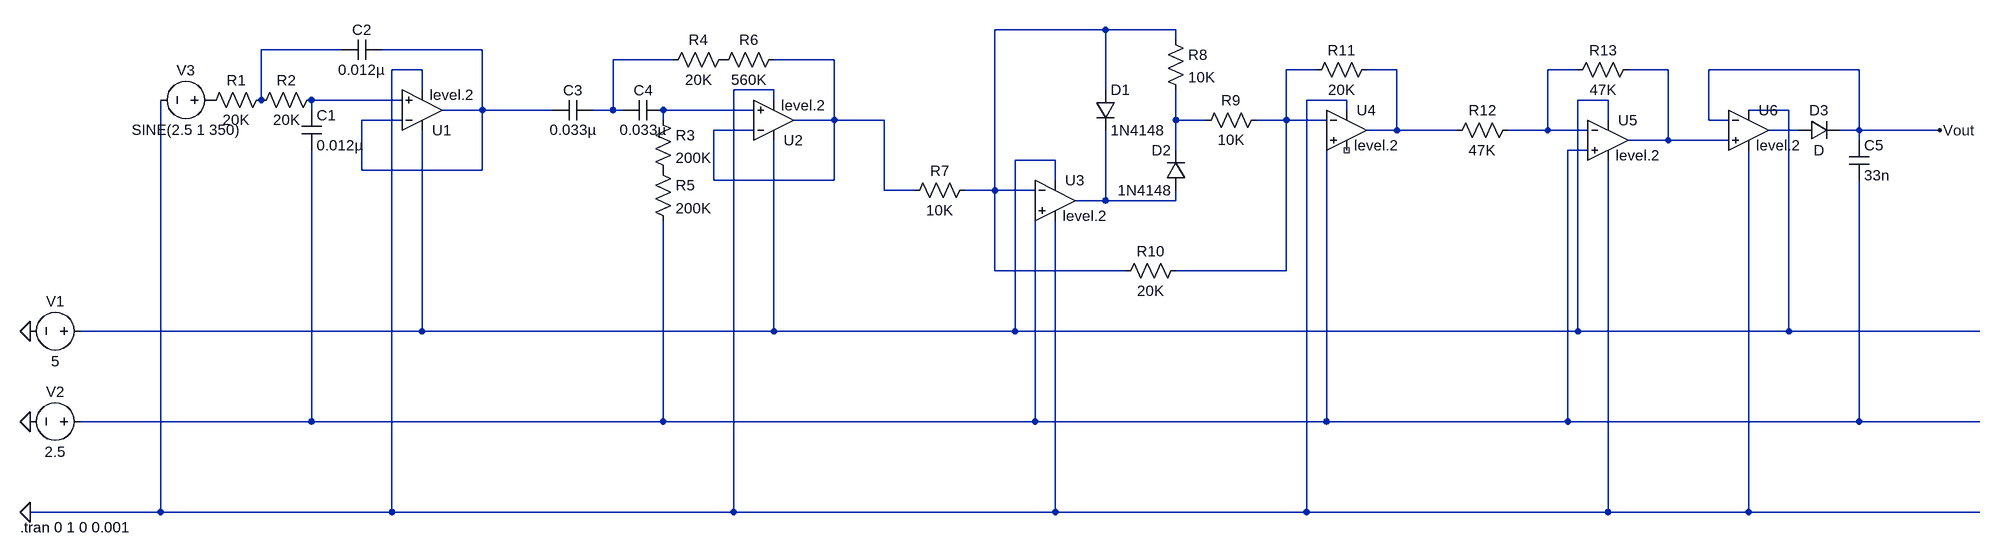
[diagram p0: schematic schematic.asc]
schematic.asc, the LTspice schematic file:
Version 4
SHEET 1 2988 880
WIRE 1424 48 1248 48
WIRE 1536 48 1424 48
WIRE 1536 64 1536 48
WIRE 208 80 80 80
WIRE 432 80 272 80
WIRE 736 96 640 96
WIRE 992 96 896 96
WIRE 336 112 288 112
WIRE 1760 112 1712 112
WIRE 1888 112 1840 112
WIRE 2176 112 2128 112
WIRE 2320 112 2256 112
WIRE 2624 112 2384 112
WIRE 336 144 336 112
WIRE 896 144 832 144
WIRE 1424 144 1424 48
WIRE 80 160 80 80
WIRE 304 160 160 160
WIRE 896 160 896 144
WIRE 1808 160 1744 160
WIRE 2224 160 2176 160
WIRE 160 176 160 160
WIRE 432 176 432 80
WIRE 432 176 368 176
WIRE 544 176 432 176
WIRE 640 176 640 96
WIRE 640 176 608 176
WIRE 656 176 640 176
WIRE 864 176 720 176
WIRE 1808 176 1808 160
WIRE 2512 176 2448 176
WIRE 304 192 240 192
WIRE 720 192 720 176
WIRE 992 192 992 96
WIRE 992 192 928 192
WIRE 1072 192 992 192
WIRE 1536 192 1536 144
WIRE 1584 192 1536 192
WIRE 1712 192 1712 112
WIRE 1712 192 1664 192
WIRE 1776 192 1712 192
WIRE 2224 192 2224 160
WIRE 2384 192 2384 112
WIRE 2416 192 2384 192
WIRE 864 208 800 208
WIRE 1888 208 1888 112
WIRE 1888 208 1840 208
WIRE 1984 208 1888 208
WIRE 2128 208 2128 112
WIRE 2128 208 2064 208
WIRE 2192 208 2128 208
WIRE 2528 208 2480 208
WIRE 2624 208 2624 112
WIRE 2624 208 2592 208
WIRE 2752 208 2624 208
WIRE 2320 224 2320 112
WIRE 2320 224 2256 224
WIRE 2416 224 2320 224
WIRE 2624 224 2624 208
WIRE 1536 240 1536 192
WIRE 2192 240 2160 240
WIRE 1344 256 1280 256
WIRE 240 272 240 192
WIRE 432 272 432 176
WIRE 432 272 240 272
WIRE 800 288 800 208
WIRE 992 288 992 192
WIRE 992 288 800 288
WIRE 1344 288 1344 256
WIRE 1072 304 1072 192
WIRE 1120 304 1072 304
WIRE 1248 304 1248 48
WIRE 1248 304 1200 304
WIRE 1312 304 1248 304
WIRE 1424 320 1424 208
WIRE 1424 320 1376 320
WIRE 1536 320 1536 304
WIRE 1536 320 1424 320
WIRE 1248 432 1248 304
WIRE 1456 432 1248 432
WIRE 1712 432 1712 192
WIRE 1712 432 1536 432
WIRE 336 528 336 208
WIRE 336 528 -208 528
WIRE 896 528 896 224
WIRE 896 528 336 528
WIRE 1280 528 1280 256
WIRE 1280 528 896 528
WIRE 2176 528 2176 160
WIRE 2176 528 1280 528
WIRE 2512 528 2512 176
WIRE 2512 528 2176 528
WIRE 2816 528 2512 528
WIRE 160 672 160 240
WIRE 160 672 -208 672
WIRE 720 672 720 352
WIRE 720 672 160 672
WIRE 1312 672 1312 336
WIRE 1312 672 720 672
WIRE 1776 672 1776 224
WIRE 1776 672 1312 672
WIRE 2160 672 2160 240
WIRE 2160 672 1776 672
WIRE 2624 672 2624 288
WIRE 2624 672 2160 672
WIRE 2816 672 2624 672
WIRE -80 816 -80 160
WIRE -80 816 -288 816
WIRE 288 816 288 112
WIRE 288 816 -80 816
WIRE 832 816 832 144
WIRE 832 816 288 816
WIRE 1344 816 1344 352
WIRE 1344 816 832 816
WIRE 1744 816 1744 160
WIRE 1744 816 1344 816
WIRE 2224 816 2224 256
WIRE 2224 816 1744 816
WIRE 2448 816 2448 240
WIRE 2448 816 2224 816
WIRE 2816 816 2448 816
FLAG -288 816 0
FLAG -288 528 0
FLAG -288 672 0
FLAG 2752 208 Vout
SYMBOL res 96 144 R90
WINDOW 0 0 56 VBottom 2
WINDOW 3 32 56 VTop 2
SYMATTR InstName R1
SYMATTR Value 20K
SYMBOL res 176 144 R90
WINDOW 0 0 56 VBottom 2
WINDOW 3 32 56 VTop 2
SYMATTR InstName R2
SYMATTR Value 20K
SYMBOL cap 144 176 R0
SYMATTR InstName C1
SYMATTR Value 0.012µ
SYMBOL opamps\\UniversalOpamp2 336 176 M180
WINDOW 38 12 24 Left 2
SYMATTR InstName U1
SYMATTR Value2 Avol=0.14Meg GBW=1.2Meg Slew=0.5Meg
SYMATTR SpiceLine ilimit=25m rail=0.5 Vos=0.2e-3 phimargin=56
SYMATTR SpiceLine2 en=0 enk=0 in=0 ink=0 Rin=10Meg
SYMBOL cap 272 64 R90
WINDOW 0 0 32 VBottom 2
WINDOW 3 32 32 VTop 2
SYMATTR InstName C2
SYMATTR Value 0.012µ
SYMBOL opamps\\UniversalOpamp2 896 192 M180
WINDOW 38 12 24 Left 2
SYMATTR InstName U2
SYMATTR Value2 Avol=0.14Meg GBW=1.2Meg Slew=0.5Meg
SYMATTR SpiceLine ilimit=25m rail=0.5 Vos=0.2e-3 phimargin=56
SYMATTR SpiceLine2 en=0 enk=0 in=0 ink=0 Rin=10Meg
SYMBOL res 704 176 R0
SYMATTR InstName R3
SYMATTR Value 200K
SYMBOL res 832 80 R90
WINDOW 0 0 56 VBottom 2
WINDOW 3 32 56 VTop 2
SYMATTR InstName R4
SYMATTR Value 20K
SYMBOL cap 608 160 R90
WINDOW 0 0 32 VBottom 2
WINDOW 3 32 32 VTop 2
SYMATTR InstName C3
SYMATTR Value 0.033µ
SYMBOL cap 720 160 R90
WINDOW 0 0 32 VBottom 2
WINDOW 3 32 32 VTop 2
SYMATTR InstName C4
SYMATTR Value 0.033µ
SYMBOL res 704 256 R0
SYMATTR InstName R5
SYMATTR Value 200K
SYMBOL res 912 80 R90
WINDOW 0 0 56 VBottom 2
WINDOW 3 32 56 VTop 2
SYMATTR InstName R6
SYMATTR Value 560K
SYMBOL voltage -192 528 R90
WINDOW 0 -32 56 VBottom 2
WINDOW 3 32 56 VTop 2
WINDOW 123 0 0 Left 0
WINDOW 39 0 0 Left 0
SYMATTR InstName V1
SYMATTR Value 5
SYMBOL voltage -192 672 R90
WINDOW 0 -32 56 VBottom 2
WINDOW 3 32 56 VTop 2
WINDOW 123 0 0 Left 0
WINDOW 39 0 0 Left 0
SYMATTR InstName V2
SYMATTR Value 2.5
SYMBOL res 1216 288 R90
WINDOW 0 0 56 VBottom 2
WINDOW 3 32 56 VTop 2
SYMATTR InstName R7
SYMATTR Value 10K
SYMBOL opamps\\UniversalOpamp2 1344 320 R0
WINDOW 38 12 24 Left 2
SYMATTR InstName U3
SYMATTR Value2 Avol=0.14Meg GBW=1.2Meg Slew=0.5Meg
SYMATTR SpiceLine ilimit=25m rail=0.5 Vos=0.2e-3 phimargin=56
SYMATTR SpiceLine2 en=0 enk=0 in=0 ink=0 Rin=10Meg
SYMBOL diode 1408 144 R0
SYMATTR InstName D1
SYMATTR Value 1N4148
SYMBOL diode 1552 304 R180
WINDOW 0 24 64 Left 2
WINDOW 3 24 0 Left 2
SYMATTR InstName D2
SYMATTR Value 1N4148
SYMBOL res 1520 48 R0
SYMATTR InstName R8
SYMATTR Value 10K
SYMBOL res 1680 176 R90
WINDOW 0 0 56 VBottom 2
WINDOW 3 32 56 VTop 2
SYMATTR InstName R9
SYMATTR Value 10K
SYMBOL opamps\\UniversalOpamp2 1808 208 R0
WINDOW 38 12 24 Left 2
SYMATTR InstName U4
SYMATTR Value2 Avol=0.14Meg GBW=1.2Meg Slew=0.5Meg
SYMATTR SpiceLine ilimit=25m rail=0.5 Vos=0.2e-3 phimargin=56
SYMATTR SpiceLine2 en=0 enk=0 in=0 ink=0 Rin=10Meg
SYMBOL res 1856 96 R90
WINDOW 0 0 56 VBottom 2
WINDOW 3 32 56 VTop 2
SYMATTR InstName R11
SYMATTR Value 20K
SYMBOL voltage 16 160 R90
WINDOW 0 -32 56 VBottom 2
WINDOW 3 32 56 VTop 2
WINDOW 123 0 0 Left 0
WINDOW 39 0 0 Left 0
SYMATTR InstName V3
SYMATTR Value SINE(2.5 1 350)
SYMBOL res 1552 416 R90
WINDOW 0 0 56 VBottom 2
WINDOW 3 32 56 VTop 2
SYMATTR InstName R10
SYMATTR Value 20K
SYMBOL res 2080 192 R90
WINDOW 0 0 56 VBottom 2
WINDOW 3 32 56 VTop 2
SYMATTR InstName R12
SYMATTR Value 47K
SYMBOL opamps\\UniversalOpamp2 2224 224 R0
WINDOW 38 12 24 Left 2
SYMATTR InstName U5
SYMATTR Value2 Avol=0.14Meg GBW=1.2Meg Slew=0.5Meg
SYMATTR SpiceLine ilimit=25m rail=0.5 Vos=0.2e-3 phimargin=56
SYMATTR SpiceLine2 en=0 enk=0 in=0 ink=0 Rin=10Meg
SYMBOL res 2272 96 R90
WINDOW 0 0 56 VBottom 2
WINDOW 3 32 56 VTop 2
SYMATTR InstName R13
SYMATTR Value 47K
SYMBOL opamps\\UniversalOpamp2 2448 208 R0
WINDOW 38 12 24 Left 2
SYMATTR InstName U6
SYMATTR Value2 Avol=0.14Meg GBW=1.2Meg Slew=0.5Meg
SYMATTR SpiceLine ilimit=25m rail=0.5 Vos=0.2e-3 phimargin=56
SYMATTR SpiceLine2 en=0 enk=0 in=0 ink=0 Rin=10Meg
SYMBOL diode 2528 224 R270
WINDOW 0 32 32 VTop 2
WINDOW 3 0 32 VBottom 2
SYMATTR InstName D3
SYMBOL cap 2608 224 R0
SYMATTR InstName C5
SYMATTR Value 33n
TEXT -304 840 Left 2 !.tran 0 1 0 0.001

The netlist it stands for:
* schematic.asc
R1 N002 P001 20K
R2 N010 N002 20K
C1 N010 N015 0.012µ
XU1 N010 N003 N011 0 N003 level.2 Avol=0.14Meg GBW=1.2Meg Slew=0.5Meg ilimit=25m rail=0.5 Vos=0.2e-3 phimargin=56 en=0 enk=0 in=0 ink=0 Rin=10Meg  ; pins IN+ IN- V+ V- OUT
C2 N003 N002 0.012µ
XU2 N012 N005 N011 0 N005 level.2 Avol=0.14Meg GBW=1.2Meg Slew=0.5Meg ilimit=25m rail=0.5 Vos=0.2e-3 phimargin=56 en=0 enk=0 in=0 ink=0 Rin=10Meg  ; pins IN+ IN- V+ V- OUT
R3 N012 P002 200K
R4 P003 N004 20K
C3 N004 N003 0.033µ
C4 N012 N004 0.033µ
R5 P002 N015 200K
R6 N005 P003 560K
V1 N011 0 5
V2 N015 0 2.5
R7 N001 N005 10K
XU3 N015 N001 N011 0 N016 level.2 Avol=0.14Meg GBW=1.2Meg Slew=0.5Meg ilimit=25m rail=0.5 Vos=0.2e-3 phimargin=56 en=0 enk=0 in=0 ink=0 Rin=10Meg  ; pins IN+ IN- V+ V- OUT
D1 N001 N016 1N4148
D2 N016 N013 1N4148
R8 N001 N013 10K
R9 N006 N013 10K
XU4 N015 N006 0 NC_01 N007 level.2 Avol=0.14Meg GBW=1.2Meg Slew=0.5Meg ilimit=25m rail=0.5 Vos=0.2e-3 phimargin=56 en=0 enk=0 in=0 ink=0 Rin=10Meg  ; pins IN+ IN- V+ V- OUT
R11 N007 N006 20K
V3 P001 0 SINE(2.5 1 350)
R10 N006 N001 20K
R12 N008 N007 47K
XU5 N015 N008 N011 0 N009 level.2 Avol=0.14Meg GBW=1.2Meg Slew=0.5Meg ilimit=25m rail=0.5 Vos=0.2e-3 phimargin=56 en=0 enk=0 in=0 ink=0 Rin=10Meg  ; pins IN+ IN- V+ V- OUT
R13 N009 N008 47K
XU6 N009 Vout N011 0 N014 level.2 Avol=0.14Meg GBW=1.2Meg Slew=0.5Meg ilimit=25m rail=0.5 Vos=0.2e-3 phimargin=56 en=0 enk=0 in=0 ink=0 Rin=10Meg  ; pins IN+ IN- V+ V- OUT
D3 N014 Vout D
C5 Vout N015 33n
.model D D
.lib standard.dio
.tran 0 1 0 0.001
.lib UniversalOpamps2.sub
.backanno
.end